# Altium schematic sheet Fan FETs and Thermo.SchDoc
size A
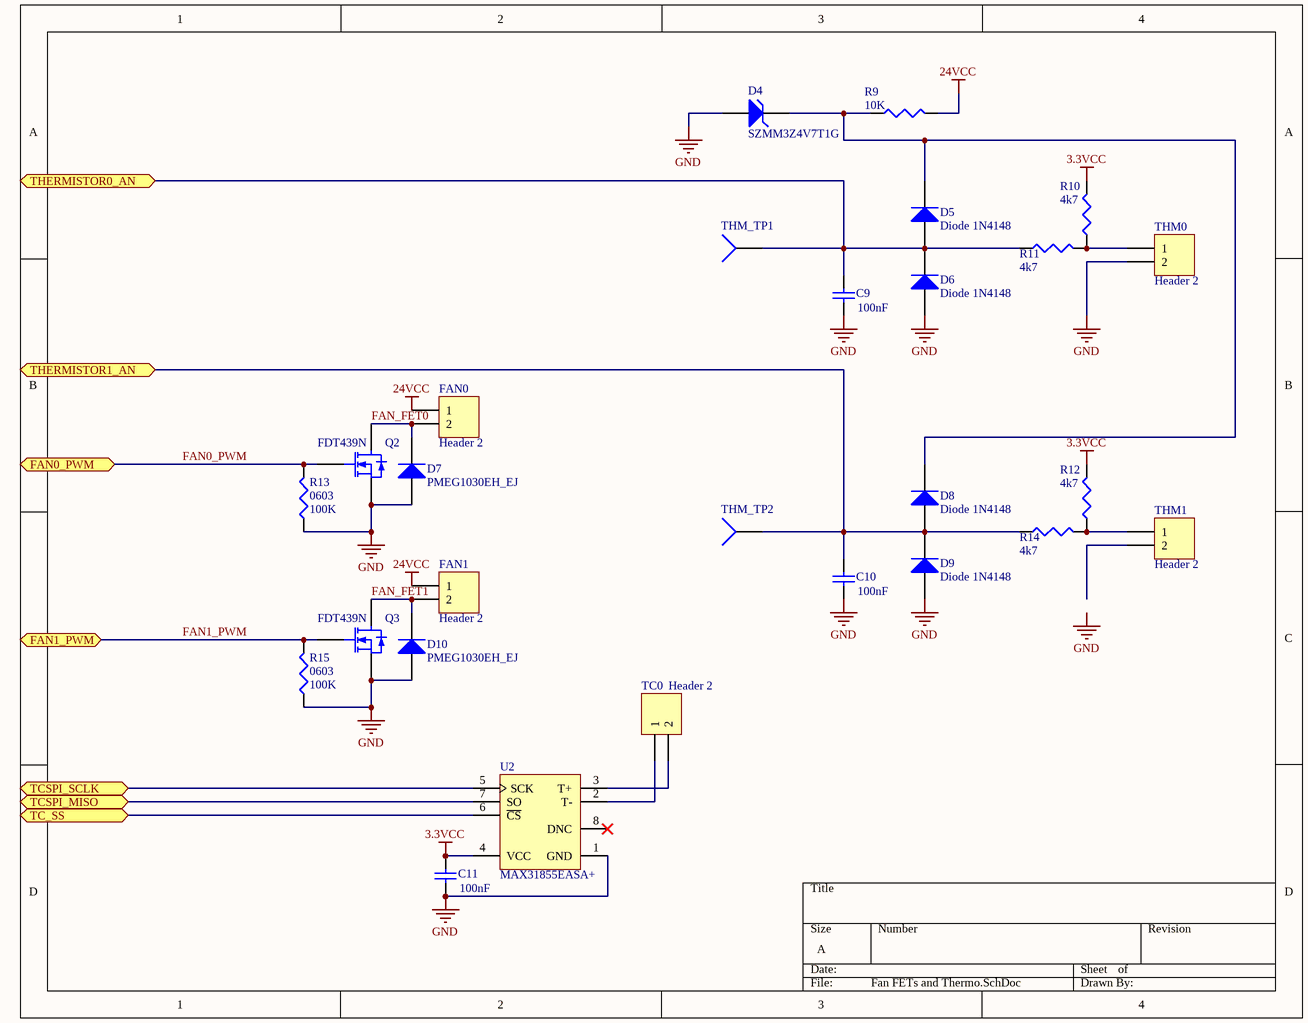
[diagram p0: Fan FETs and Thermo.SchDoc]

## Parts
C9  value 100nF  [1608[0603]]  (hidden comment: Cap Semi)
C10  value 100nF  [1608[0603]]  (hidden comment: Cap Semi)
C11  value 100nF  [1608[0603]]  (hidden comment: Cap Semi)
D4  SZMM3Z4V7T1G  [SZMM3Z4V7T1G]
D5  Diode 1N4148  [1N4148WT]
D6  Diode 1N4148  [1N4148WT]
D7  PMEG1030EH_EJ  [SOD-323]
D8  Diode 1N4148  [1N4148WT]
D9  Diode 1N4148  [1N4148WT]
D10  PMEG1030EH_EJ  [SOD-323]
FAN0  Header 2  [HDR1X2]
FAN1  Header 2  [HDR1X2]
Q2  FDT439N  [Fairchild FDT439N]
Q3  FDT439N  [Fairchild FDT439N]
R9  value 10K  [J1-0603]  (hidden comment: Res3)
R10  value 4k7  [J1-0603]  (hidden comment: Res3)
R11  value 4k7  [J1-0603]  (hidden comment: Res3)
R12  value 4k7  [J1-0603]  (hidden comment: Res3)
R13  0603  value 100K  [J1-0603]
R14  value 4k7  [J1-0603]  (hidden comment: Res3)
R15  0603  value 100K  [J1-0603]
TC0  Header 2  [HDR1X2]
THM0  Header 2  [HDR1X2]
THM1  Header 2  [HDR1X2]
THM_TP1  TP4  [PIN1]  (value not drawn)
THM_TP2  TP4  [PIN1]  (value not drawn)
U2  MAX31855EASA+  [MAXM-S8+4_N]

## Ports
FAN0_PWM, FAN1_PWM, TC_SS, TCSPI_MISO, TCSPI_SCLK, THERMISTOR0_AN, THERMISTOR1_AN

## Nets
2: Q2.4(D) Q3.4(D)
3.3VCC: C11.2 R10.2 R12.2 U2.4(VCC)
24VCC: FAN0.1 FAN1.1 R9.2
GND: C9.1 C10.1 C11.1 D4.1(A) D6.1(A) D7.1(A) D9.1(A) D10.1(A) Q2.3(S) Q3.3(S) R13.1 R15.1 THM0.2 U2.1(GND)
FAN0_PWM: Q2.1(G) R13.2 ; port FAN0_PWM
FAN1_PWM: Q3.1(G) R15.2 ; port FAN1_PWM
FAN_FET0: D7.2(K) FAN0.2 Q2.2(D)
FAN_FET1: D10.2(K) FAN1.2 Q3.2(D)
TC_SS: U2.6(~{CS}) ; port TC_SS
TCSPI_MISO: U2.7(SO) ; port TCSPI_MISO
TCSPI_SCLK: U2.5(SCK) ; port TCSPI_SCLK
THERMISTOR0_AN: C9.2 D5.1(A) D6.2(K) R11.1 THM_TP1.1 ; port THERMISTOR0_AN
THERMISTOR1_AN: C10.2 D8.1(A) D9.2(K) R14.1 THM_TP2.1 ; port THERMISTOR1_AN
NetD4_2: D4.2(K) D5.2(K) D8.2(K) R9.1
NetR10_1: R10.1 R11.2 THM0.1
NetR12_1: R12.1 R14.2 THM1.1
NetTC0_1: TC0.1 U2.2(T-)
NetTC0_2: TC0.2 U2.3(T+)

Not connected (* = marked no-connect by the designer): THM1 2; U2 8(DNC)*

## Notes on the sheet
- Labels drawn without touching a wire or pin: GND

## Library data of the parts
C9-C11 = Cap Semi: Capacitor (Semiconductor SIM Model); Published: 8-Jun-2000; LatestRevisionDate: 29-May-2009; LatestRevisionNote: IPC-7351 Footprint Added.; PackageReference: C1206; Publisher: Altium Limited; PackageDescription: Chip Capacitor
D4 = D Zener: Zener Diode; Published: 8-Jun-2000; LatestRevisionDate: 17-Jul-2002; LatestRevisionNote: Re-released for DXP Platform.; PackageReference: DIODE-0.7; Publisher: Altium Limited; PackageDescription: Diode, Thru-Hole; 2 Leads; 0.7 in Pin Spacing
D5 D6 D8 D9 = Diode 1N4148: High Conductance Fast Diode; Published: 8-Jun-2000; LatestRevisionDate: 17-Jul-2002; LatestRevisionNote: Re-released for DXP Platform.; DatasheetVersion: 1997; PackageReference: DO-35; Publisher: Altium Limited; PackageDescription: Diode, Axial; Body 3.8 x 1.9 mm (LxDia. max), Lead Dia. 0.53 mm (max); Code_JEDEC: DO-204-AH; ComponentLink1Description: Manufacturer Link; ComponentLink1URL: http://www.fairchildsemi.com/; ComponentLink2Description: Datasheet; ComponentLink2URL: http://www.fairchildsemi.com/ds/1N%2F1N4148.pdf
D7 D10 = Diode: Default Diode; Published: 8-Jun-2000; LatestRevisionDate: 17-Jul-2002; LatestRevisionNote: Re-released for DXP Platform.; PackageVersion: Sep-1996; PackageReference: SMC; Publisher: Altium Limited; PackageDescription: DO-214-AB/SMC; 2 C-Bend Leads; Body 7.9 x 5.9 mm, inc. leads (LxW); Code_JEDEC: DO-214-AB
FAN0 FAN1 TC0 THM0 THM1 = Header 2: Header, 2-Pin; LatestRevisionDate: 17-Jul-2002; LatestRevisionNote: Re-released for DXP Platform.; Publisher: Altium Limited
Q2 Q3 = Fairchild FDT439N: N-Channel MOSFET; Published: 8-Jun-2000; LatestRevisionDate: 17-Jul-2002; LatestRevisionNote: Re-released for DXP Platform.; PackageVersion: 1995/1996; PackageReference: E3; Publisher: Altium Limited; PackageDescription: TO, Flat Index; 3 In-Line, Axial Leads; Body Dia. 4.6mm; Lead Dia. 0.5 mm (max)
R9-R15 = Res3: Resistor; Published: 8-Jun-2000; LatestRevisionDate: 29-May-2009; LatestRevisionNote: IPC-7351 Footprint Added.; PackageReference: J1-0603; Publisher: Altium Limited; PackageDescription: Chip Resistor
THM_TP1 THM_TP2 = Socket: LatestRevisionDate: 17-Jul-2002; LatestRevisionNote: Re-released for DXP Platform.; Publisher: Altium Limited
U2 = MAX31855EASA+: Cold Junction Compensated Thermocouple to Digital Converter, 14 Bits Temperature Resolution, -40 to 125 degC, 8-Pin SOIC (S8+4), Pb-Free; Functions: Thermocouple-to-Digital Converter; Interface: SPI; Parasite Pwr.: No; DatasheetVersion: Rev. 2; PackageVersion: Rev. D, 10/2012; PackageReference: S8+4; PackageDescription: 8-Pin Small-Outline IC, Narrow, Body 3.9 x 4.9 mm, Pitch 1.27 mm; Supplier 1: Digi-Key; Supplier Part Number 1: MAX31855EASA+-ND; Supplier 2: Mouser; Supplier Part Number 2: 700-MAX31855EASA+; Generic Part Number: MAX31855; Mounting Technology: Surface Mount; Code_JEDEC: MS-012; PartNumber: MAX31855EASA+; ComponentLink1Description: Manufacturer URL; ComponentLink1URL: http://www.maximintegrated.com/; ComponentLink2Description: Datasheet; ComponentLink2URL: http://datasheets.maximintegrated.com/en/ds/MAX31855.pdf; ComponentLink3Description: Package Specification; ComponentLink3URL: http://pdfserv.maximintegrated.com/package_dwgs/21-0041.PDF